# EAGLE design untitled (EAGLE 6.5.0)
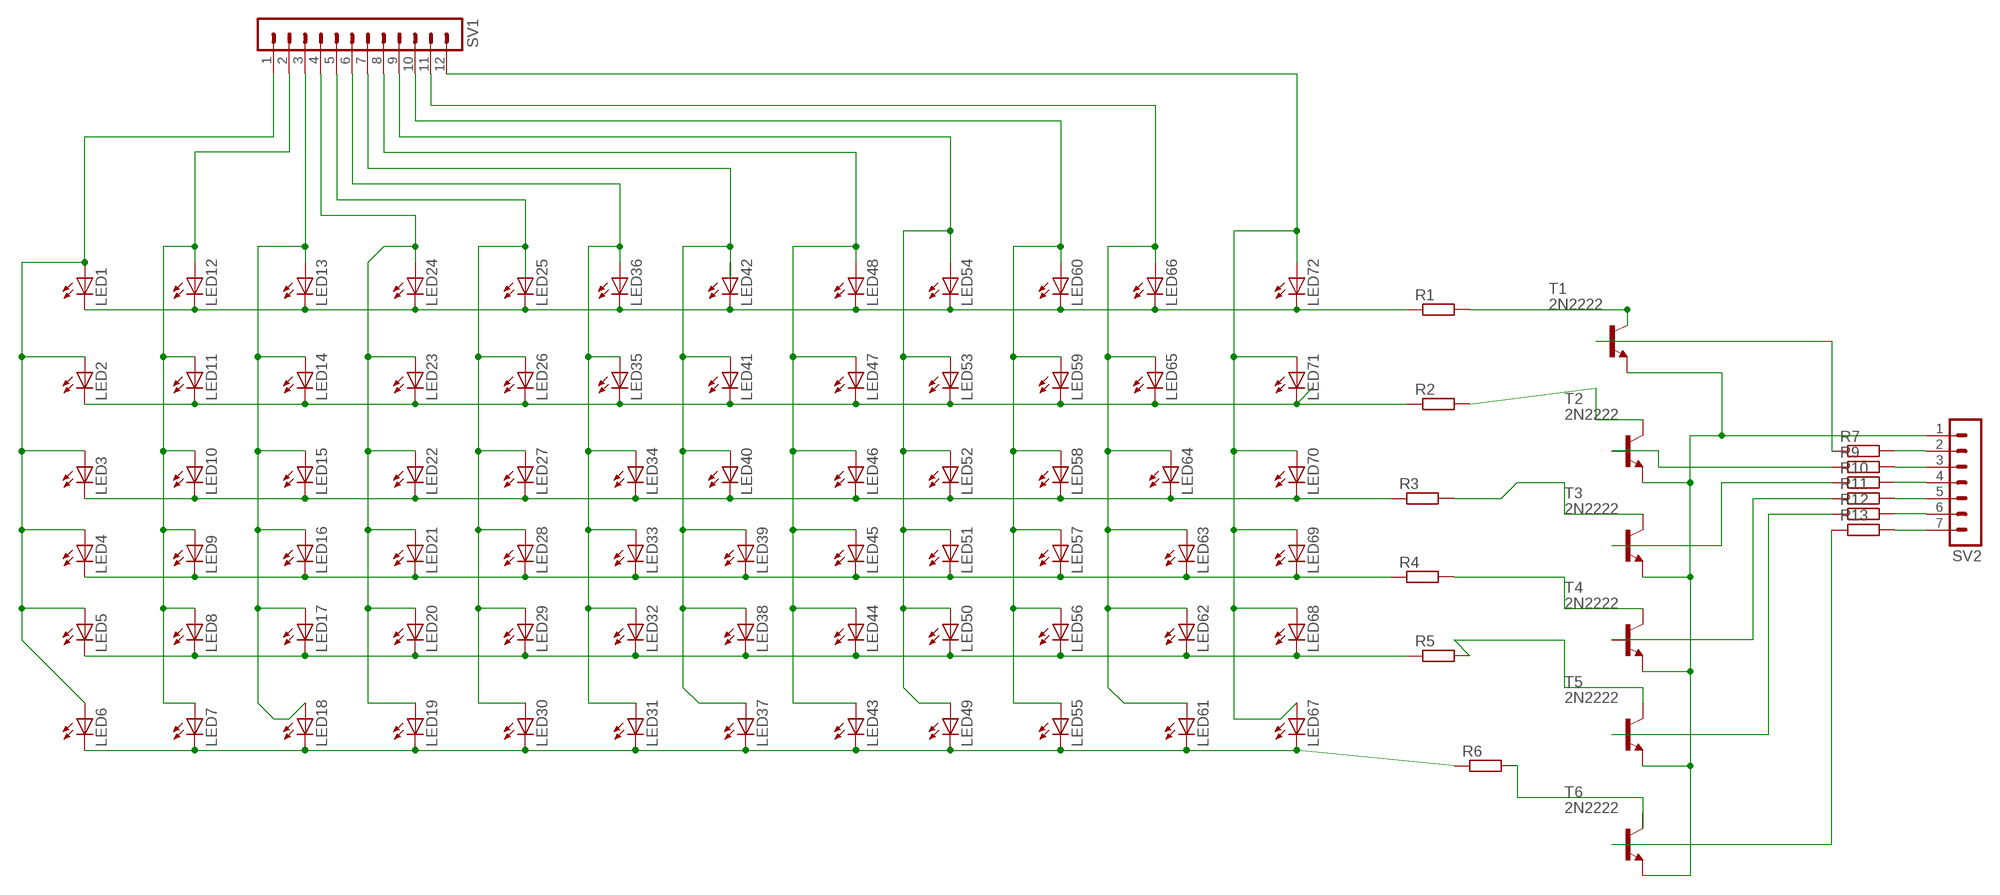
[diagram p0: schematic, sheet 1]

## Parts
LED1  LED5MM  [LED5MM]
LED2  LED5MM  [LED5MM]
LED3  LED5MM  [LED5MM]
LED4  LED5MM  [LED5MM]
LED5  LED5MM  [LED5MM]
LED6  LED5MM  [LED5MM]
LED7  LED5MM  [LED5MM]
LED8  LED5MM  [LED5MM]
LED9  LED5MM  [LED5MM]
LED10  LED5MM  [LED5MM]
LED11  LED5MM  [LED5MM]
LED12  LED5MM  [LED5MM]
LED13  LED5MM  [LED5MM]
LED14  LED5MM  [LED5MM]
LED15  LED5MM  [LED5MM]
LED16  LED5MM  [LED5MM]
LED17  LED5MM  [LED5MM]
LED18  LED5MM  [LED5MM]
LED19  LED5MM  [LED5MM]
LED20  LED5MM  [LED5MM]
LED21  LED5MM  [LED5MM]
LED22  LED5MM  [LED5MM]
LED23  LED5MM  [LED5MM]
LED24  LED5MM  [LED5MM]
LED25  LED5MM  [LED5MM]
LED26  LED5MM  [LED5MM]
LED27  LED5MM  [LED5MM]
LED28  LED5MM  [LED5MM]
LED29  LED5MM  [LED5MM]
LED30  LED5MM  [LED5MM]
LED31  LED5MM  [LED5MM]
LED32  LED5MM  [LED5MM]
LED33  LED5MM  [LED5MM]
LED34  LED5MM  [LED5MM]
LED35  LED5MM  [LED5MM]
LED36  LED5MM  [LED5MM]
LED37  LED5MM  [LED5MM]
LED38  LED5MM  [LED5MM]
LED39  LED5MM  [LED5MM]
LED40  LED5MM  [LED5MM]
LED41  LED5MM  [LED5MM]
LED42  LED5MM  [LED5MM]
LED43  LED5MM  [LED5MM]
LED44  LED5MM  [LED5MM]
LED45  LED5MM  [LED5MM]
LED46  LED5MM  [LED5MM]
LED47  LED5MM  [LED5MM]
LED48  LED5MM  [LED5MM]
LED49  LED5MM  [LED5MM]
LED50  LED5MM  [LED5MM]
LED51  LED5MM  [LED5MM]
LED52  LED5MM  [LED5MM]
LED53  LED5MM  [LED5MM]
LED54  LED5MM  [LED5MM]
LED55  LED5MM  [LED5MM]
LED56  LED5MM  [LED5MM]
LED57  LED5MM  [LED5MM]
LED58  LED5MM  [LED5MM]
LED59  LED5MM  [LED5MM]
LED60  LED5MM  [LED5MM]
LED61  LED5MM  [LED5MM]
LED62  LED5MM  [LED5MM]
LED63  LED5MM  [LED5MM]
LED64  LED5MM  [LED5MM]
LED65  LED5MM  [LED5MM]
LED66  LED5MM  [LED5MM]
LED67  LED5MM  [LED5MM]
LED68  LED5MM  [LED5MM]
LED69  LED5MM  [LED5MM]
LED70  LED5MM  [LED5MM]
LED71  LED5MM  [LED5MM]
LED72  LED5MM  [LED5MM]
R1  R-EU_0207/10  [0207/10]
R2  R-EU_0207/10  [0207/10]
R3  R-EU_0207/10  [0207/10]
R4  R-EU_0207/10  [0207/10]
R5  R-EU_0207/10  [0207/10]
R6  R-EU_0207/10  [0207/10]
R7  R-EU_0207/10  [0207/10]
R9  R-EU_0207/10  [0207/10]
R10  R-EU_0207/10  [0207/10]
R11  R-EU_0207/10  [0207/10]
R12  R-EU_0207/10  [0207/10]
R13  R-EU_0207/10  [0207/10]
SV1  MA12-1  [MA12-1]
SV2  MA07-1  [MA07-1]
T1  2N2222  [TO18]
T2  2N2222  [TO18]
T3  2N2222  [TO18]
T4  2N2222  [TO18]
T5  2N2222  [TO18]
T6  2N2222  [TO18]

## Nets
N$1: R1.2 T1.3(C)
N$2: LED1.K(C) LED12.K(C) LED13.K(C) LED24.K(C) LED25.K(C) LED36.K(C) LED42.K(C) LED48.K(C) LED54.K(C) LED60.K(C) LED66.K(C) LED72.K(C) R1.1
N$3: LED2.K(C) LED11.K(C) LED14.K(C) LED23.K(C) LED26.K(C) LED35.K(C) LED41.K(C) LED47.K(C) LED53.K(C) LED59.K(C) LED65.K(C) LED71.K(C) R2.1
N$4: R2.2 T2.3(C)
N$5: R3.2 T3.3(C)
N$6: R4.2 T4.3(C)
N$7: LED3.K(C) LED10.K(C) LED15.K(C) LED22.K(C) LED27.K(C) LED34.K(C) LED40.K(C) LED46.K(C) LED52.K(C) LED58.K(C) LED64.K(C) LED70.K(C) R3.1
N$8: R5.2 T5.3(C)
N$9: R6.2 T6.3(C)
N$10: LED4.K(C) LED9.K(C) LED16.K(C) LED21.K(C) LED28.K(C) LED33.K(C) LED39.K(C) LED45.K(C) LED51.K(C) LED57.K(C) LED63.K(C) LED69.K(C) R4.1
N$11: LED7.A LED8.A LED9.A LED10.A LED11.A LED12.A SV1.2
N$12: LED13.A LED14.A LED15.A LED16.A LED17.A LED18.A SV1.3
N$13: LED19.A LED20.A LED21.A LED22.A LED23.A LED24.A SV1.4
N$14: LED25.A LED26.A LED27.A LED28.A LED29.A LED30.A SV1.5
N$15: LED31.A LED32.A LED33.A LED34.A LED35.A LED36.A SV1.6
N$16: LED37.A LED38.A LED39.A LED40.A LED41.A LED42.A SV1.7
N$17: LED43.A LED44.A LED45.A LED46.A LED47.A LED48.A SV1.8
N$18: LED49.A LED50.A LED51.A LED52.A LED53.A LED54.A SV1.9
N$19: LED55.A LED56.A LED57.A LED58.A LED59.A LED60.A SV1.10
N$20: LED61.A LED62.A LED63.A LED64.A LED65.A LED66.A SV1.11
N$21: LED67.A LED68.A LED69.A LED70.A LED71.A LED72.A SV1.12
N$22: SV2.1 T1.1(E) T2.1(E) T3.1(E) T4.1(E) T5.1(E) T6.1(E)
N$23: LED1.A LED2.A LED3.A LED4.A LED5.A LED6.A SV1.1
N$24: LED5.K(C) LED8.K(C) LED17.K(C) LED20.K(C) LED29.K(C) LED32.K(C) LED38.K(C) LED44.K(C) LED50.K(C) LED56.K(C) LED62.K(C) LED68.K(C) R5.1
N$25: R7.1 T1.2(B)
N$26: R7.2 SV2.2
N$27: LED6.K(C) LED7.K(C) LED18.K(C) LED19.K(C) LED30.K(C) LED31.K(C) LED37.K(C) LED43.K(C) LED49.K(C) LED55.K(C) LED61.K(C) LED67.K(C) R6.1
N$28: R9.1 T2.2(B)
N$29: R9.2 SV2.3
N$30: R10.2 SV2.4
N$31: R11.2 SV2.5
N$32: R12.2 SV2.6
N$33: R11.1 T4.2(B)
N$34: R13.2 SV2.7
N$35: R10.1 T3.2(B)
N$36: R12.1 T5.2(B)
N$37: R13.1 T6.2(B)

## Library data of the parts
LED1-LED72 = led:LED: LED OSRAM: - CHIPLED LG R971, LG N971, LY N971, LG Q971, LY Q971, LO R971, LY R971 LH N974, LH R974 LS Q976, LO Q976, LY Q976 LO Q996 - Hyper CHIPLED LW Q18S LB Q993, LB Q99A, LB R99A - SideLED LS A670, LO A670, LY A670, LG A670, LP A670 LB A673, LV A673, LT A673, LW A673 LH A674 LY A675 LS A676, LA A676, LO A676, LY A676, LW A676 LS A679, LY A679, LG A679 - Hyper Micro SIDELED® LS Y876, LA Y876, LO Y876, LY Y876 LT Y87S - SmartLED LW L88C, LW L88S LB L89C, LB L89S, LG L890 LS L89K, LO L89K, LY L89K LS L896, LA L896, LO L896, LY L896 - TOPLED LS T670, LO T670, LY T670, LG T670, LP T670 LSG T670, LSP T670, LSY T670, LOP T670, LYG T670 LG T671, LOG T671, LSG T671 LB T673, LV T673, LT T673, LW T673 LH T674 LS T676, LA T676, LO T676, LY T676, LB T676, LH T676, LSB T676, LW T676 LB T67C, LV T67C, LT T67C, LS T67K, LO T67K, LY T67K, LW E67C LS E67B, LA E67B, LO E67B, LY E67B, LB E67C, LV E67C, LT E67C LW T67C LS T679, LY T679, LG T679 LS T770, LO T770, LY T770, LG T770, LP T770 LB T773, LV T773, LT T773, LW T773 LH T774 LS E675, LA E675, LY E675, LS T675 LS T776, LA T776, LO T776, LY T776, LB T776 LHGB T686 LT T68C, LB T68C - Hyper Mini TOPLED® LB M676 - Mini TOPLED Santana® LG M470 LS M47K, LO M47K, LY M47K Source: http://www.osram.convergy.de LUXEON: - LUMILED® LXK2-PW12-R00, LXK2-PW12-S00, LXK2-PW14-U00, LXK2-PW14-V00 LXK2-PM12-R00, LXK2-PM12-S00, LXK2-PM14-U00 LXK2-PE12-Q00, LXK2-PE12-R00, LXK2-PE12-S00, LXK2-PE14-T00, LXK2-PE14-U00 LXK2-PB12-K00, LXK2-PB12-L00, LXK2-PB12-M00, LXK2-PB14-N00, LXK2-PB14-P00, LXK2-PB14-Q00 LXK2-PR12-L00, LXK2-PR12-M00, LXK2-PR14-Q00, LXK2-PR14-R00 LXK2-PD12-Q00, LXK2-PD12-R00, LXK2-PD12-S00 LXK2-PH12-R00, LXK2-PH12-S00 LXK2-PL12-P00, LXK2-PL12-Q00, LXK2-PL12-R00 Source: www.luxeon.com KINGBRIGHT: KA-3528ASYC Source: www.kingbright.com
R1-R7 R9-R13 = rcl:R-EU_: RESISTOR, European symbol
SV1 = con-lstb:MA12-1: PIN HEADER; OC_FARNELL: unknown; OC_NEWARK: unknown
SV2 = con-lstb:MA07-1: PIN HEADER; OC_FARNELL: unknown; OC_NEWARK: unknown
T1-T6 = transistor:2N2222: NPN TRANSISTOR

## Board
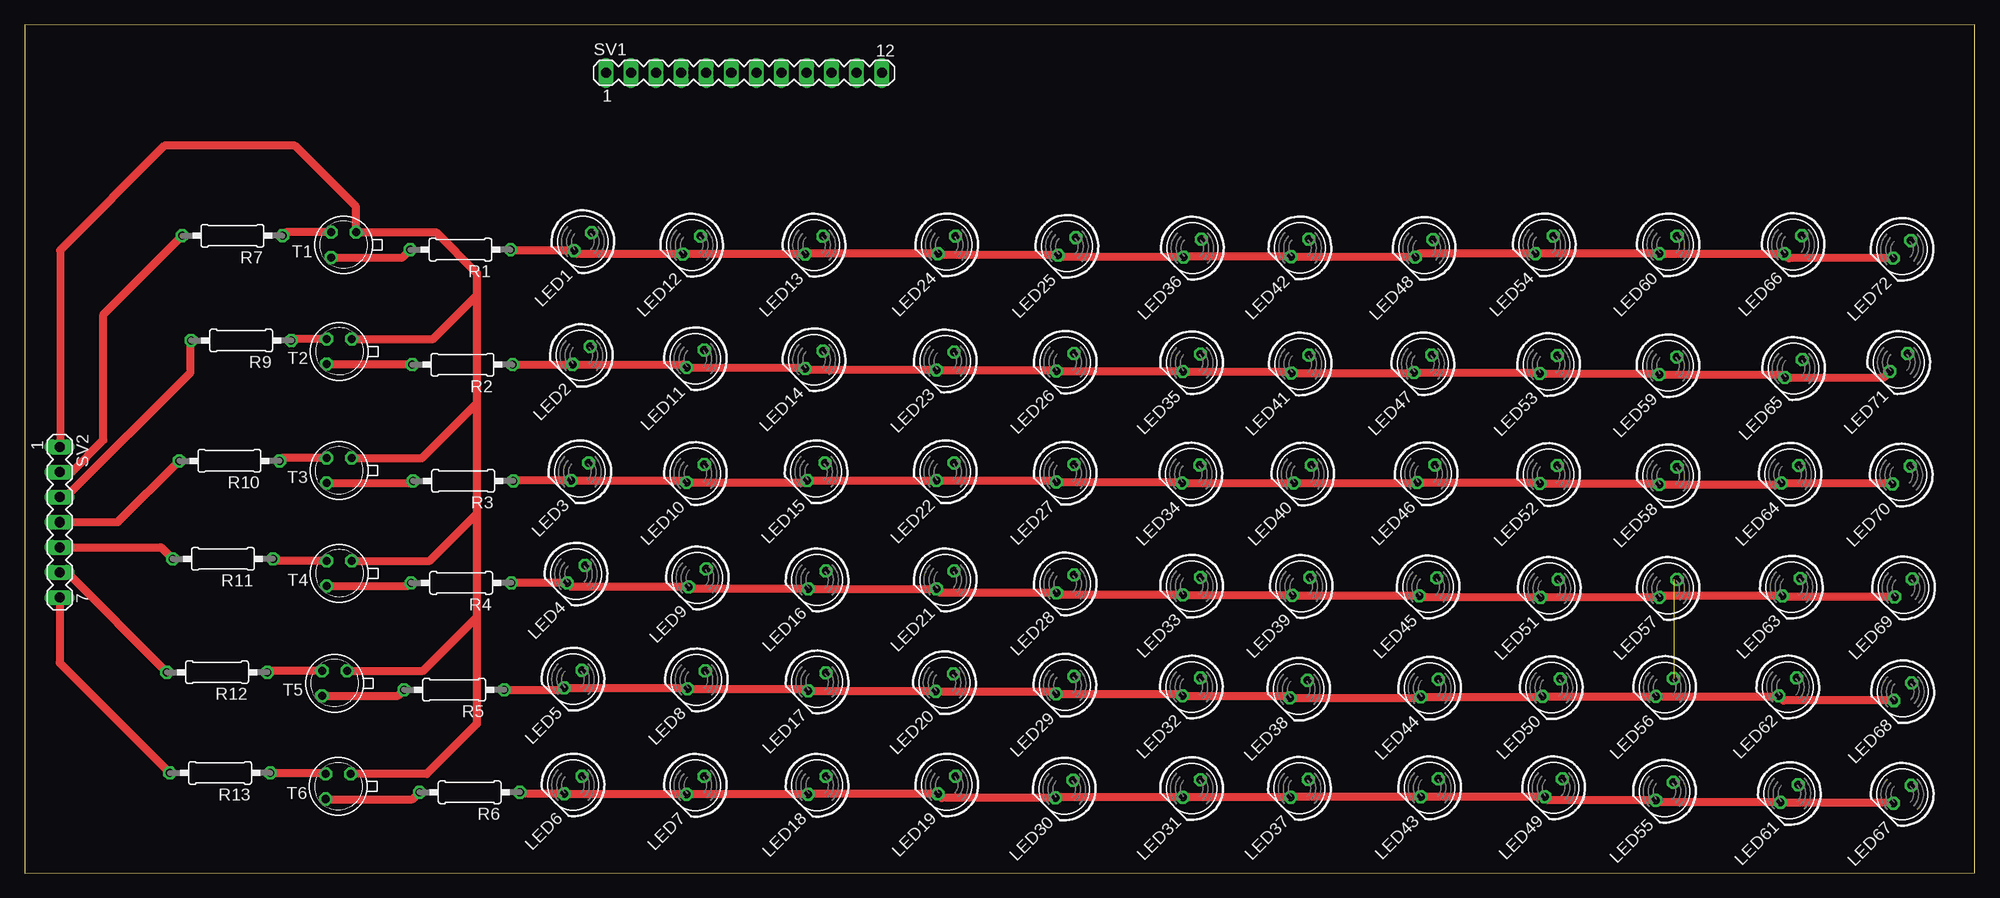
[diagram p1: board, top side]
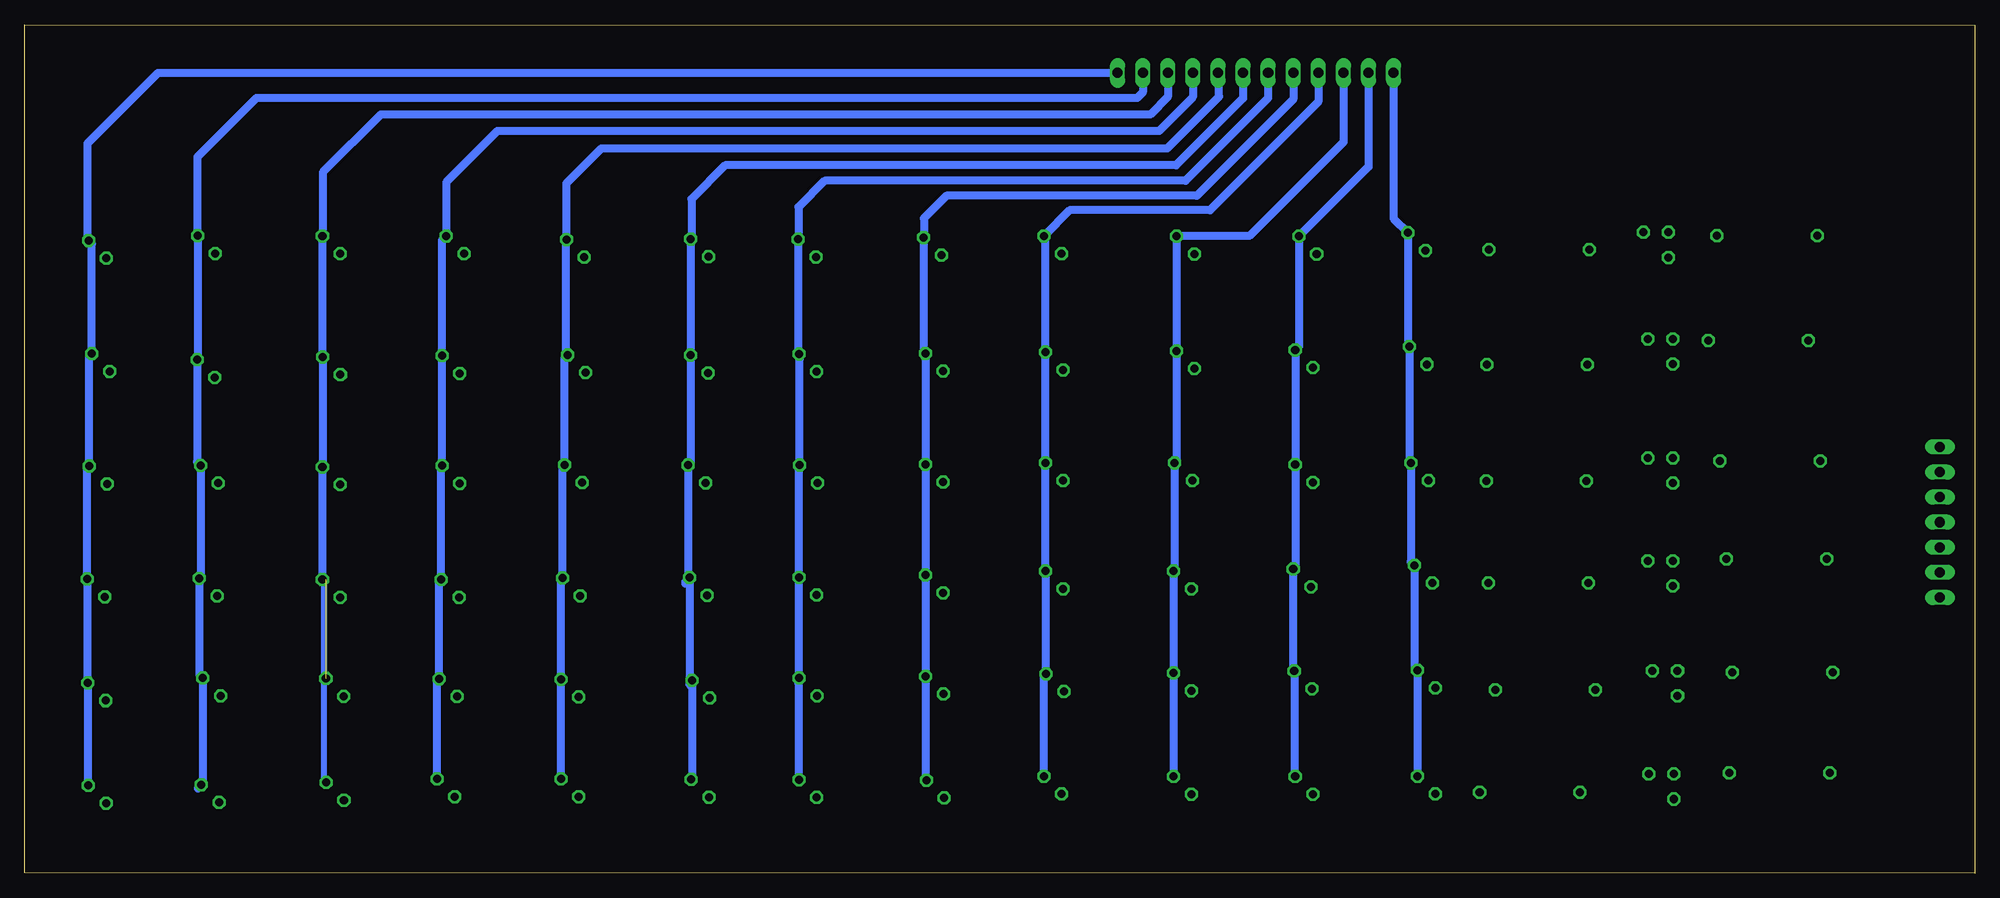
[diagram p2: board, bottom side, seen from below]

Size 197.47 x 85.95 mm. Coordinates in mm from the lower left corner, seen from the top.
Outline: 0,0 197.47,0.08 197.47,85.95 0,85.88 0,0
Copper layers (1*16): Top 0.035mm / dielectric 1.5mm / Bottom 0.035mm
Design rules "default": minimum track width 10mil, minimum drill 24mil, track to track 8mil, track to pad 8mil, pad to pad 8mil, via to via 8mil, smd to smd 8mil, copper to edge 40mil, drill to drill 8mil, minimum pad ring 10mil, minimum via ring 8mil, stop-mask expansion 4mil, vias tented up to drill 0mil, thermal gap 10mil

### Footprints (pad centres in the part's own frame; a part is rotated, then mirrored left to right if it is on the bottom)
LED5MM = drill 0.813 octagon: A -1.27,0; K 1.27,0
0207/10 = drill 0.813 octagon: 1 -5.08,0; 2 5.08,0
MA12-1 = drill 1.016 long: 1 -13.97,0; 2 -11.43,0; 3 -8.89,0; 4 -6.35,0; 5 -3.81,0; 6 -1.27,0; 7 1.27,0; 8 3.81,0; 9 6.35,0; 10 8.89,0; 11 11.43,0; 12 13.97,0
MA07-1 = drill 1.016 long: 1 -7.62,0; 2 -5.08,0; 3 -2.54,0; 4 0,0; 5 2.54,0; 6 5.08,0; 7 7.62,0
TO18 = drill 0.813 octagon: 1 -1.27,-1.27; 2 1.27,-1.27; 3 1.27,1.27

### Placement (x,y rotation side)
LED1  56.51,63.98 225 top
LED2  56.36,52.45 225 top
LED3  56.21,40.67 225 top
LED4  55.83,30.3 225 top
LED5  55.52,19.66 225 top
LED6  55.52,8.94 225 top
LED7  67.92,8.92 225 top
LED8  68.02,19.58 225 top
LED9  68.12,29.92 225 top
LED10  67.92,40.49 225 top
LED11  67.92,52.12 225 top
LED12  67.54,63.63 225 top
LED13  79.93,63.63 225 top
LED14  79.93,52.02 225 top
LED15  80.14,40.67 225 top
LED16  80.24,29.72 225 top
LED17  80.24,19.38 225 top
LED18  80.24,8.92 225 top
LED19  93.37,8.94 225 top
LED20  93.14,19.3 225 top
LED21  93.22,29.72 225 top
LED22  93.22,40.67 225 top
LED23  93.22,51.89 225 top
LED24  93.37,63.65 225 top
LED25  105.54,63.5 225 top
LED26  105.36,51.77 225 top
LED27  105.36,40.51 225 top
LED28  105.36,29.31 225 top
LED29  105.33,19.05 225 top
LED30  105.26,8.53 225 top
LED31  118.16,8.59 225 top
LED32  118.14,18.87 225 top
LED33  118.16,29.08 225 top
LED34  118.08,40.44 225 top
LED35  118.16,51.71 225 top
LED36  118.24,63.32 225 top
LED37  129.08,8.61 225 top
LED38  129.01,18.64 225 top
LED39  129.26,29.06 225 top
LED40  129.41,40.44 225 top
LED41  129.16,51.59 225 top
LED42  129.13,63.35 225 top
LED43  142.27,8.66 225 top
LED44  142.27,18.75 225 top
LED45  142.11,29.01 225 top
LED46  141.91,40.46 225 top
LED47  141.58,51.61 225 top
LED48  141.71,63.3 225 top
LED49  154.81,8.66 225 top
LED50  154.58,18.8 225 top
LED51  154.38,28.85 225 top
LED52  154.31,40.39 225 top
LED53  154.31,51.54 225 top
LED54  153.87,63.65 225 top
LED55  166.04,8.31 225 top
LED56  166.07,18.82 225 top
LED57  166.42,28.85 225 top
LED58  166.42,40.26 225 top
LED59  166.4,51.41 225 top
LED60  166.42,63.65 225 top
LED61  178.69,8.08 225 top
LED62  178.54,18.87 225 top
LED63  178.89,28.98 225 top
LED64  178.77,40.41 225 top
LED65  179.12,51.13 225 top
LED66  179.07,63.68 225 top
LED67  190.12,8 225 top
LED68  190.17,18.39 225 top
LED69  190.25,28.91 225 top
LED70  190.02,40.34 225 top
LED71  189.76,51.74 225 top
LED72  190.09,63.2 225 top
R1  44.12,63.17 180 top
R2  44.32,51.51 180 top
R3  44.4,39.75 180 top
R4  44.2,29.41 180 top
R5  43.48,18.59 180 top
R6  45.06,8.2 180 top
R7  21.03,64.57 180 top
R9  21.92,53.98 180 top
R10  20.73,41.78 180 top
R11  20.07,31.85 180 top
R12  19.48,20.37 180 top
R13  19.79,10.16 180 top
SV1  72.82,81.08 0 top
SV2  3.53,35.56 270 top
T1  32.28,63.65 180 top
T2  31.85,52.86 180 top
T3  31.83,40.79 180 top
T4  31.85,30.38 180 top
T5  31.37,19.25 180 top
T6  31.75,8.79 180 top

### Tracks (layer width: path | path; a pad name or v marks a point on that pad's centre or on a via)
N$1
  Top 0.813: T1.3 38.25,62.38 R1.2
N$2
  Top 0.813: R1.1 49.29,63.08 LED1.K 55.97,62.73 LED12.K LED13.K 79.06,62.75 LED24.K 92.62,62.6 LED25.K 104.82,62.42 LED36.K 117.36,62.45 LED42.K 128.29,62.4 LED48.K 141.16,62.75 LED54.K LED60.K 178.15,62.75 LED66.K 178.66,62.3 LED72.K
N$3
  Top 0.813: R2.1 55.42,51.51 LED2.K 66.69,51.55 LED11.K 78.93,51.22 LED14.K 79.16,50.99 LED23.K 104.33,50.99 LED26.K 117.21,50.87 LED35.K 128.13,50.82 LED41.K 140.66,50.69 LED47.K 153.33,50.72 LED53.K 165.37,50.64 LED59.K 177.94,50.51 LED65.K 188.26,50.23 LED71.K
N$4
  Top 0.813: R2.2 30.66,51.51 T2.3
N$5
  Top 0.813: T3.3 39.09,39.52 R3.2
N$6
  Top 0.813: T4.3 38.81,29.11 R4.2
N$7
  Top 0.813: LED70.K 189.04,39.51 LED64.K 177.72,39.36 LED58.K 165.4,39.49 LED52.K 153.33,39.56 LED46.K 140.99,39.54 LED40.K LED34.K 117.11,39.62 LED27.K 104.31,39.77 LED22.K LED15.K 79.06,39.59 LED10.K 66.84,39.77 LED3.K 49.5,39.77 R3.1
N$8
  Top 0.813: T5.3 37.79,17.98 R5.2
N$9
  Top 0.813: T6.3 39.29,7.52 R6.2
N$10
  Top 0.813: LED69.K 178.07,28.01 LED63.K 165.65,28.08 LED57.K LED51.K 141.37,27.96 LED45.K 128.41,28.11 LED39.K 117.29,28.16 LED33.K 104.69,28.19 LED28.K 92.73,28.41 LED21.K LED16.K 67.43,28.82 LED9.K 55.31,29.02 LED4.K 49.29,29.4 R4.1
N$11
  Bottom 0.813: SV1.2 61.39,71.57 LED12.A 68.44,53.4 LED11.A LED10.A 68.82,31.02 LED9.A 69.02,20.58 LED8.A 68.92,9.92 LED7.A
N$12
  Bottom 0.813: LED18.A LED17.A LED16.A 81.03,30.72 LED15.A 80.83,41.77 LED14.A LED13.A 80.81,64.54 73.46,64.54 63.93,74.07 SV1.3
N$13
  Bottom 0.813: LED19.A 94.27,19.97 LED20.A 94.04,30.54 LED21.A LED22.A LED23.A 94.12,64.4 LED24.A 91.66,67.16 77.44,67.16 66.47,78.13 SV1.4
N$14
  Bottom 0.813: SV1.5 69.01,78.38 78.77,68.63 104.14,68.63 106.43,66.35 106.43,64.41 LED25.A 106.44,52.84 LED26.A LED27.A LED28.A 106.26,19.97 LED29.A 106.23,9.51 LED30.A
N$15
  Bottom 0.813: SV1.6 71.55,78.51 79.91,70.16 116.46,70.16 119.13,67.49 LED36.A 119.13,52.27 118.98,52.12 | LED31.A 119.06,19.19 119.13,19.25 119.13,19.68 LED32.A 119.03,29.96 LED33.A 119.06,41.26 LED34.A 118.98,52.12 | 118.98,52.12 118.98,52.54 LED35.A
N$16
  Bottom 0.813: SV1.7 74.09,78.49 80.87,71.7 126.54,71.7 129.95,68.3 129.95,64.33 LED42.A 130.03,52.51 LED41.A 130.06,41.59 LED40.A 130.31,29.58 130.56,29.34 130.56,29.56 LED39.A 130.16,19.14 129.97,18.95 129.97,19.47 LED38.A 129.91,9.59 LED37.A
N$17
  Bottom 0.813: 142.67,64.34 142.61,64.27 LED48.A 142.61,69.89 139.06,73.43 81.76,73.43 76.53,78.66 76.53,80.98 SV1.8 | 142.67,64.34 142.67,64.36 | 142.67,64.34 142.67,52.71 LED47.A 142.81,52.18 LED46.A 143.01,41.16 LED45.A 143.16,29.75 LED44.A LED43.A
N$18
  Bottom 0.813: SV1.9 79.17,78.61 82.6,75.18 149.61,75.18 154.79,70 154.79,64.57 LED54.A 155.2,64.12 LED53.A LED52.A 155.28,41.21 LED51.A 155.48,29.55 LED50.A 155.71,19.47 LED49.A
N$19  (1 unrouted)
  Bottom 0.406: LED57.A 166.96,29.75 | LED56.A 166.94,19.72
  Bottom 0.61: 166.96,29.75 167.18,29.75 167.18,9.2 LED55.A
  Bottom 0.813: SV1.10 81.71,78.64 83.49,76.86 161.42,76.86 167.28,70.99 167.28,64.59 LED60.A 167.32,52.33 LED59.A 167.29,41.18 LED58.A LED57.A
N$20
  Bottom 0.813: SV1.11 84.25,79.1 84.84,78.51 174.02,78.51 179.98,72.54 179.98,64.59 LED66.A 179.97,52.08 LED65.A 180.02,41.67 LED64.A 179.66,30.01 LED63.A 179.79,20.13 LED62.A 179.44,9.03 179.91,8.56 179.91,8.65 LED61.A
N$21
  Bottom 0.813: SV1.12 86.72,81.08 86.69,81.05 183.97,81.05 191.11,73.91 191.11,64.21 LED72.A 190.66,63.76 LED71.A 190.91,52.38 LED70.A 191.14,41 LED69.A 191.07,29.73 LED68.A 191.02,19.24 LED67.A
N$22
  Top 0.813: 45.77,58.52 45.77,60.81 41.66,64.92 T1.1 33.55,67.51 27.38,73.69 14.15,73.69 3.58,63.12 3.58,43.23 SV2.1 | 45.77,58.52 45.77,47.6 | 45.77,47.6 45.77,36.4 | 45.77,36.4 45.77,25.93 | 45.77,25.93 45.77,15.11 40.72,10.06 T6.1 | T5.1 40.36,20.52 45.77,25.93 | T4.1 41.02,31.65 45.77,36.4 | T3.1 40.23,42.06 45.77,47.6 | T2.1 41.38,54.13 45.77,58.52
N$23
  Bottom 0.813: SV1.1 58.85,66.32 LED1.A 57.41,53.5 LED2.A 57.26,41.72 LED3.A 57.11,31.58 LED4.A 56.73,20.86 LED5.A LED6.A
N$24
  Top 0.813: R5.1 54.46,18.59 LED5.K 67.05,18.76 LED8.K 79.14,18.69 LED17.K 92.17,18.48 LED20.K 104.18,18.41 LED29.K 117.06,18.15 LED32.K 127.88,17.97 LED38.K 141.27,17.75 LED44.K 153.64,17.85 LED50.K 165.14,17.9 LED56.K 177.59,17.92 LED62.K 178.12,17.49 LED68.K
N$25
  Top 0.813: T1.2 26.47,64.92 R7.1
N$26
  Top 0.813: SV2.2 4.75,40.64 7.98,43.87 7.98,56.59 R7.2
N$27
  Top 0.813: R6.1 50.3,8.04 LED6.K 54.65,8.02 LED7.K LED18.K 79.37,8.04 LED19.K 92.88,7.64 LED30.K 104.41,7.69 LED31.K 117.29,7.71 LED37.K 128.24,7.76 LED43.K LED49.K 154.27,7.41 LED55.K 165.37,7.18 LED61.K 189.15,7.18 LED67.K
N$28
  Top 0.813: T2.2 27.15,54.13 R9.1
N$29
  Top 0.813: SV2.3 4.17,38.1 16.79,50.72 16.79,53.92 R9.2
N$30
  Top 0.813: SV2.4 9.42,35.56 R10.2
N$31
  Top 0.813: SV2.5 13.82,33.02 R11.2
N$32
  Top 0.813: SV2.6 4.29,30.48 R12.2
N$33
  Top 0.813: T4.2 25.35,31.65 R11.1
N$34
  Top 0.813: SV2.7 3.53,21.34 R13.2
N$35
  Top 0.813: T3.2 26.09,42.06 R10.1
N$36
  Top 0.813: T5.2 24.71,20.52 R12.1
N$37
  Top 0.813: R13.1 30.38,10.16 T6.2